# EasyEDA Pro project 2025_07_18_fpga.epro

# Schematic Schematic1
Board Name: Board1; Create Date: 2025-07-18; Page Name: P1; Project Name: 2025_07_18_fpga; Schematic Name: Schematic1; Update Date: 2025-07-22; Page Size: A4; Version: V1.0
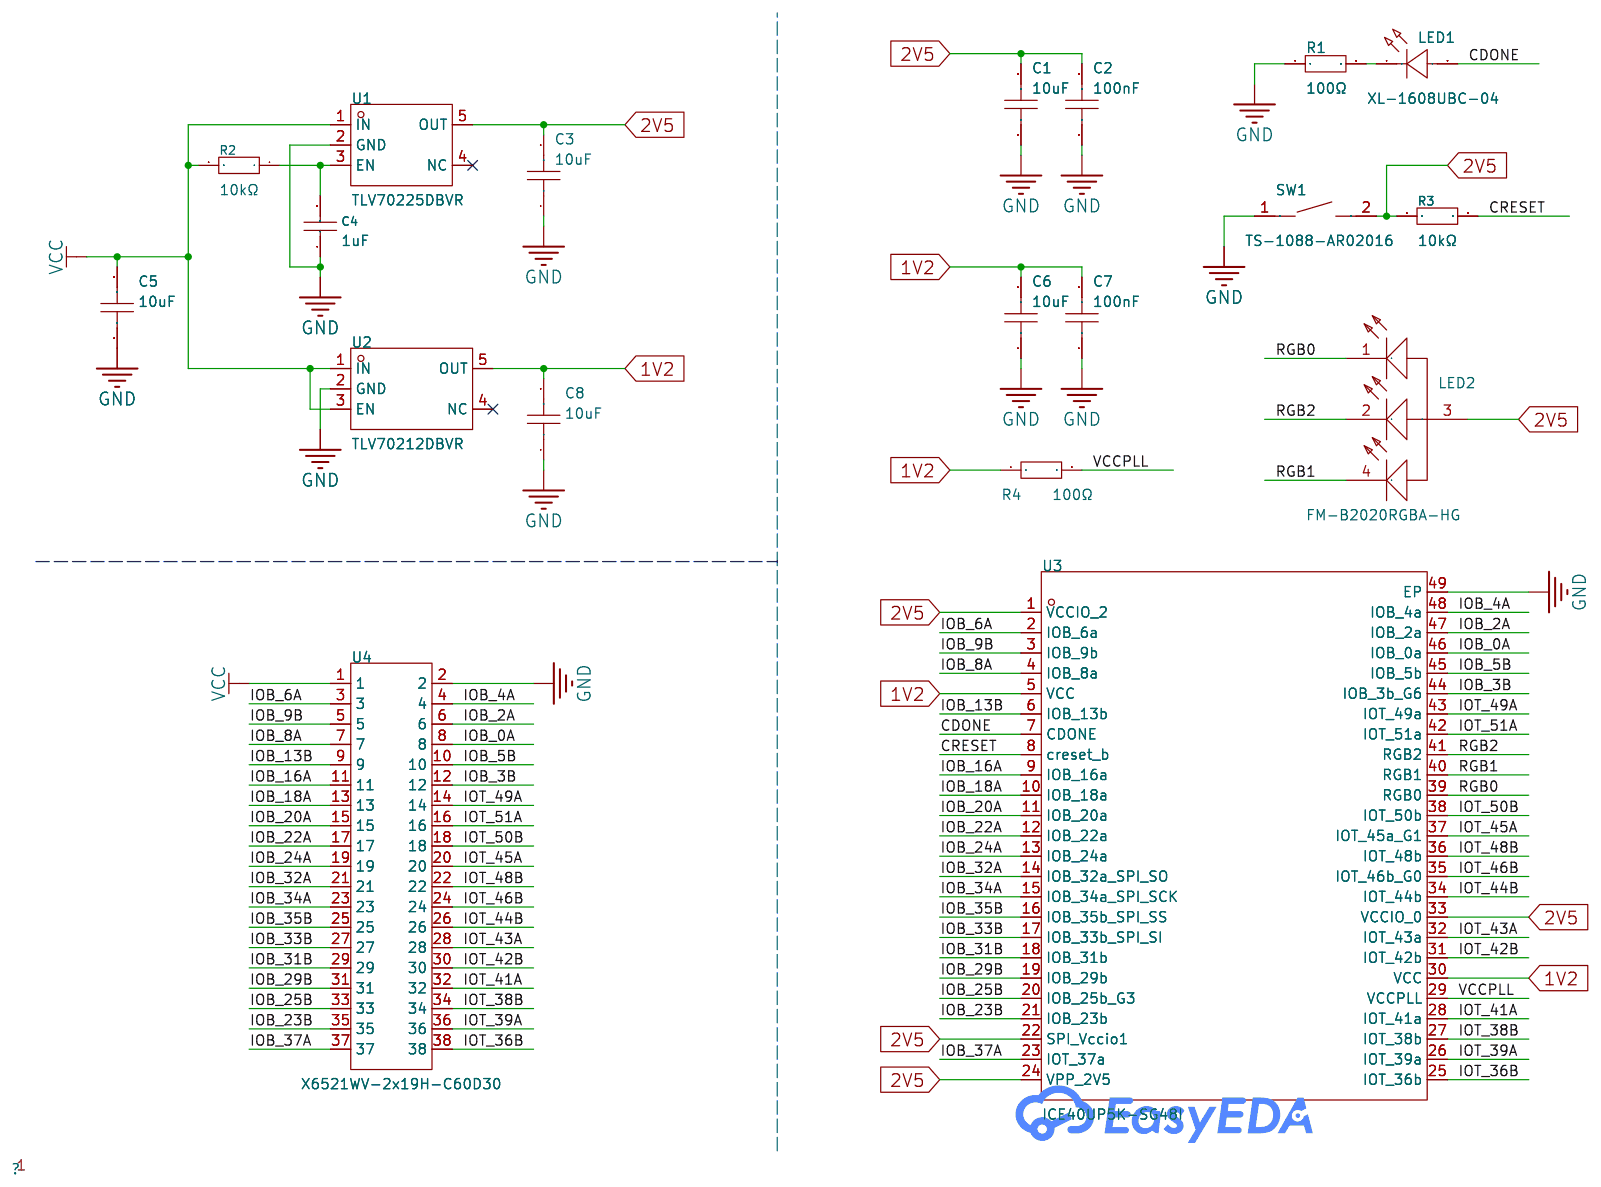
[diagram p0: schematic sheet]

## Parts
C1  10uF  [C0402]
C2  100nF  [C0402]
C3  10uF  [C0402]
C4  1uF  [C0402]
C5  10uF  [C0402]
C6  10uF  [C0402]
C7  100nF  [C0402]
C8  10uF  [C0402]
LED1  XL-1608UBC-04  [LED0603-RD_BLUE]
LED2  FM-B2020RGBA-HG  [LED-SMD_FM-B2020RGBA-HG]
R1  100Ω  [R0402]
R2  10kΩ  [R0402]
R3  10kΩ  [R0402]
R4  100Ω  [R0402]
SW1  TS-1088-AR02016  [SW-SMD_L3.9-W3.0-P4.45]
U1  TLV70225DBVR  [SOT-23-5_L2.9-W1.6-P0.95-LS2.8-BR]
U2  TLV70212DBVR  [SOT-23-5_L3.0-W1.7-P0.95-LS2.8-BL]
U3  ICE40UP5K-SG48I  [QFN-48_L7.0-W7.0-P0.50-TL-EP5.4-1]
U4  X6521WV-2x19H-C60D30  [HDR-TH_38P-P2.54-V-M-R2-C19-S2.54]

## Library data of the parts
C1 C3 C5 C6 C8 = CL05A106MP5NUNC_C315248: Capacitance: Tolerance:±20% Tolerance:±20% Voltage Rated: Temperature Coefficient:; LCSC Part Name: 10uF ±20% 10V; Supplier Part: C315248; Manufacturer: SAMSUNG(三星); Manufacturer Part: CL05A106MP5NUNC; Supplier Footprint: 0402; JLCPCB Part Class: Extended Part; Datasheet: https://atta.szlcsc.com/upload/public/pdf/source/20231220/1EF805BAE1520675928CC4638D279E74.pdf; Supplier: LCSC; Tolerance: ±20%
C2 C7 = CL05B104KO5NNNC: Capacitance: Tolerance:±10% Tolerance:±10% Voltage Rated: Temperature Coefficient:; LCSC Part Name: 100nF ±10% 16V; Supplier Part: C1525; Manufacturer: SAMSUNG(三星); Supplier Footprint: 0402; JLCPCB Part Class: Basic Part; Datasheet: https://atta.szlcsc.com/upload/public/pdf/source/20160218/1457707763339.pdf; Supplier: LCSC; Tolerance: ±10%
C4 = CL05A105KO5NNNC: Capacitance: Tolerance:±10% Tolerance:±10% Voltage Rated: Temperature Coefficient:; LCSC Part Name: 1uF ±10% 16V; Supplier Part: C29266; Manufacturer: SAMSUNG(三星); Supplier Footprint: 0402; JLCPCB Part Class: Extended Part; Datasheet: https://atta.szlcsc.com/upload/public/pdf/source/20160218/1457707763339.pdf; Supplier: LCSC; Tolerance: ±10%
LED1 = XL-1608UBC-04: Emitted Color:Blue Power Dissipation:80mW Forward Current:25mA Dominant Wavelength:460nm~469nm Dominant Wavelength:460nm~469nm Peak Wavelength:475nm Lens Color:无色透明透镜 Color Temperature:- Color Temperature:- Viewing Angle:120° Mounting Sytle:Positive post; Supplier Part: C965807; Manufacturer: XINGLIGHT(成兴光); Supplier Footprint: 0603; JLCPCB Part Class: Extended Part; Datasheet: https://atta.szlcsc.com/upload/public/pdf/source/20240218/F76B043D1CDACE9DB8357580572EF0D5.pdf; Supplier: LCSC; Emitted Color: Blue; Power Dissipation: 80mW; Forward Current: 25mA; Dominant Wavelength: 460nm~469nm; Peak Wavelength: 475nm; Lens Color: 无色透明透镜; Viewing Angle: 120°; Mounting Sytle: Positive post; Operating Temperature: -30℃~+85℃
LED2 = FM-B2020RGBA-HG: Diode Configuration:Common Anode Dominant Wavelength:B:470nm；G:525nm；R:622nm Luminous Intensity:G:170mcd；R:55mcd；B:25mcd Viewing Angle:110° Forward Current:R:8mA；G:5mA；B:3mA Forward Voltage:R:2V；B:3V；G:3V Installation Method:Positive Stick Operating Tempe; Supplier Part: C108793; Manufacturer: 国星光电; Supplier Footprint: SMD,2.1x2.1mm; JLCPCB Part Class: Extended Part; Datasheet: https://atta.szlcsc.com/upload/public/pdf/source/20180518/C108793_2518890ED811E900864AC79152D9E220.pdf; Supplier: LCSC; Diode Configuration: Common Anode; Dominant Wavelength: B:470nm；G:525nm；R:622nm; Luminous Intensity: G:170mcd；R:55mcd；B:25mcd; Viewing Angle: 110°; Forward Current: R:8mA；G:5mA；B:3mA; Forward Voltage: R:2V；B:3V；G:3V; Installation Method: Positive Stick; Operating Temperature: -30℃~+85℃
R1 R4 = RC0402FR-07100RL: Type:Thick Film Resistors Resistance: Tolerance:±1% Tolerance:±1% Power(Watts): Overload Voltage (Max): Temperature Coefficient:±100ppm/℃ Temperature Coefficient:±100ppm/℃ Operating Temperature Range:-55℃~+155℃ Operating Temperature Range:-55℃~+155℃; LCSC Part Name: 厚膜电阻 100Ω ±1% 62.5mW; Supplier Part: C106232; Manufacturer: YAGEO(国巨); Supplier Footprint: 0402; JLCPCB Part Class: Extended Part; Datasheet: https://atta.szlcsc.com/upload/public/pdf/source/20180927/C295883_E8D83085EA81BD7DE0B2B681138C15EE.pdf; Supplier: LCSC; Type: Thick Film Resistors; Tolerance: ±1%; Temperature Coefficient: ±100ppm/℃; Operating Temperature Range: -55℃~+155℃
R2 R3 = 0402WGJ0103TCE: Type:Thick Film Resistors Resistance:10kΩ Tolerance:±5% Tolerance:±5% Power(Watts): Overload Voltage (Max): Temperature Coefficient:±100ppm/℃ Temperature Coefficient:±100ppm/℃ Operating Temperature Range:-55℃~+155℃ Operating Temperature Range:-55℃~+155℃; LCSC Part Name: 10kΩ ±5% 62.5mW 厚膜电阻; Supplier Part: C25531; Manufacturer: UNI-ROYAL(厚声); Supplier Footprint: 0402; Datasheet: https://atta.szlcsc.com/upload/public/pdf/source/20200306/C422600_1E6D84923E4A46A82E41ADD87F860B5C.pdf; Supplier: LCSC; Type: Thick Film Resistors; Tolerance: ±5%; Temperature Coefficient: ±100ppm/℃; Operating Temperature Range: -55℃~+155℃
SW1 = TS-1088-AR02016: Circuit:SPST Actuator Style:Round Button Operating Force:160gf Mounting Style:Brick nogging Switch Length:4mm Switch Width:3mm Switch Height:2mm Strike Gundam:不带 Contact Current:50mA Voltage Rating (DC):12V Insulation Resistance:100MΩ Actuator/Cap Color:B; LCSC Part Name: 4*3*2mm 立贴 轻触开关; Supplier Part: C720477; Manufacturer: XUNPU(讯普); Supplier Footprint: SMD; JLCPCB Part Class: Basic Part; Datasheet: https://atta.szlcsc.com/upload/public/pdf/source/20200810/C720475_60D09DD6C54279ADDB2DC25100F1CC11.pdf; Supplier: LCSC; Circuit: SPST; Actuator Style: Round Button; Operating Force: 160gf; Mounting Style: Brick nogging; Switch Length: 4mm; Switch Width: 3mm; Switch Height: 2mm; Strike Gundam: 不带; Contact Current: 50mA; Voltage Rating (DC): 12V; Insulation Resistance: 100MΩ; Actuator/Cap Color: Black; Pin Style: SMDSplicing; Mechanical Life: 10万次; Operating Temperature: -30℃~+80℃
U1 = TLV70225DBVR: Output Type:Fixed Maximum Input Voltage:5.5V Output Voltage:2.5V Output Voltage:2.5V Output Current:300mA Power Supply Rejection Ratio (PSRR):68dB@(1kHz) Dropout Voltage:380mV@(300mA) standby current:55uA Feature:防静电保护；自动放电功能；低ESR；Thermal Protection(TSD)；; LCSC Part Name: 具有使能功能的 300mA、高 PSRR、低 IQ、低压降稳压器; Supplier Part: C2877849; Manufacturer: TI(德州仪器); Supplier Footprint: SOT-23-5; JLCPCB Part Class: Extended Part; Datasheet: https://www.ti.com/cn/lit/gpn/tlv702; Supplier: LCSC; Output Type: Fixed; Maximum Input Voltage: 5.5V; Output Voltage: 2.5V; Output Current: 300mA; Power Supply Rejection Ratio (PSRR): 68dB@(1kHz); Dropout Voltage: 380mV@(300mA); standby current: 55uA; Feature: 防静电保护；自动放电功能；低ESR；Thermal Protection(TSD)；欠压闭锁；Overcurrent Protection(OCP)；带使能; Operating Temperature: -40℃~+125℃@(Tj); Output Polarity: Positive electrode; Number of Outputs: 1
U2 = TLV70212DBVR: Output Type:Fixed Maximum Input Voltage:5.5V Output Voltage:1.2V Output Voltage:1.2V Output Current:300mA Power Supply Rejection Ratio (PSRR):68dB@(1kHz) Dropout Voltage:380mV@(300mA) standby current:55uA Feature:ESD Protection；Low ESR；Thermal Protection(; LCSC Part Name: 具有使能功能的 300mA、高 PSRR、低 IQ、低压降稳压器; Supplier Part: C81462; Manufacturer: TI(德州仪器); Supplier Footprint: SOT-23-5; JLCPCB Part Class: Extended Part; Datasheet: https://www.ti.com/cn/lit/gpn/tlv702; Supplier: LCSC; Output Type: Fixed; Maximum Input Voltage: 5.5V; Output Voltage: 1.2V; Output Current: 300mA; Power Supply Rejection Ratio (PSRR): 68dB@(1kHz); Dropout Voltage: 380mV@(300mA); standby current: 55uA; Feature: ESD Protection；Low ESR；Thermal Protection(TSD)；Under-voltage Lockout；Overcurrent Protection(OCP)；With ability; Operating Temperature: -40℃~+125℃@(Tj); Output Polarity: Positive electrode; Number of Outputs: 1
U3 = ICE40UP5K-SG48I: Type:- Supply Voltage Range - VCCIO:- Supply Voltage Range - VCCIO:- Logic Elements / Cells:5280 Logic Array Blocks:660 Embedded Block RAM:1171456bit Operating Temperature Range:-40℃~+100℃ Operating Temperature Range:-40℃~+100℃; LCSC Part Name: ICE40UP5K SG48I; Supplier Part: C2678152; Manufacturer: LATTICE(莱迪思); Supplier Footprint: QFN-48-EP(7x7); JLCPCB Part Class: Extended Part; Datasheet: https://atta.szlcsc.com/upload/public/pdf/source/20210913/C2889329_82E663D90B49CAF53877542F8A43E4F7.pdf; Supplier: LCSC; Logic Elements / Cells: 5280; Logic Array Blocks: 660; Embedded Block RAM: 1171456bit; Operating Temperature Range: -40℃~+100℃
U4 = X6521WV-2x19H-C60D30: Pin Structure:2x19P Pitch:2.54mm Row Spacing:2.54mm Circluar Pins/Square Pins:Policy Number of Rows:Double Row Number of Pins:38P Current Rating:3A Voltage Rating (Max):250V Length of Mating Pin:- Insulation Height:2.5mm Length of End Connection Pin:- Con; LCSC Part Name: 2x19P 间距:2.54mm 方针; Supplier Part: C2883962; Manufacturer: XKB Connection(中国星坤); Supplier Footprint: 插件,P=2.54mm; Supplier: LCSC; Pin Structure: 2x19P; Pitch: 2.54mm; Row Spacing: 2.54mm; Circluar Pins/Square Pins: Policy; Number of Rows: Double Row; Number of Pins: 38P; Current Rating: 3A; Voltage Rating (Max): 250V; Insulation Height: 2.5mm; Contact Material: Brass; Contact Plating: Gold; Operating Temperature: -40℃~+105℃; Color: Black

## Nets
1V2: C6.2 C7.2 C8.2 R4.1 U2.5(OUT) U3.5(VCC) U3.30(VCC)
2V5: C1.2 C2.2 C3.2 LED2.3(A) R3.1 SW1.2 U1.5(OUT) U3.1(VCCIO_2) U3.22(SPI_Vccio1) U3.24(VPP_2V5) U3.33(VCCIO_0)
GND: C1.1 C2.1 C3.1 C4.1 C5.1 C6.1 C7.1 C8.1 R1.1 SW1.1 U1.2(GND) U2.2(GND) U3.49(EP) U4.2
VCC: C5.2 R2.2 U1.1(IN) U2.1(IN) U2.3(EN) U4.1
VCCPLL: R4.2 U3.29(VCCPLL)
CDONE: LED1.2(A) U3.7(CDONE)
CRESET: R3.2 U3.8(creset_b)
IOB_0A: U3.46(IOB_0a) U4.8
IOB_2A: U3.47(IOB_2a) U4.6
IOB_3B: U3.44(IOB_3b_G6) U4.12
IOB_4A: U3.48(IOB_4a) U4.4
IOB_5B: U3.45(IOB_5b) U4.10
IOB_6A: U3.2(IOB_6a) U4.3
IOB_8A: U3.4(IOB_8a) U4.7
IOB_9B: U3.3(IOB_9b) U4.5
IOB_13B: U3.6(IOB_13b) U4.9
IOB_16A: U3.9(IOB_16a) U4.11
IOB_18A: U3.10(IOB_18a) U4.13
IOB_20A: U3.11(IOB_20a) U4.15
IOB_22A: U3.12(IOB_22a) U4.17
IOB_23B: U3.21(IOB_23b) U4.35
IOB_24A: U3.13(IOB_24a) U4.19
IOB_25B: U3.20(IOB_25b_G3) U4.33
IOB_29B: U3.19(IOB_29b) U4.31
IOB_31B: U3.18(IOB_31b) U4.29
IOB_32A: U3.14(IOB_32a_SPI_SO) U4.21
IOB_33B: U3.17(IOB_33b_SPI_SI) U4.27
IOB_34A: U3.15(IOB_34a_SPI_SCK) U4.23
IOB_35B: U3.16(IOB_35b_SPI_SS) U4.25
IOB_37A: U3.23(IOT_37a) U4.37
IOT_36B: U3.25(IOT_36b) U4.38
IOT_38B: U3.27(IOT_38b) U4.34
IOT_39A: U3.26(IOT_39a) U4.36
IOT_41A: U3.28(IOT_41a) U4.32
IOT_42B: U3.31(IOT_42b) U4.30
IOT_43A: U3.32(IOT_43a) U4.28
IOT_44B: U3.34(IOT_44b) U4.26
IOT_45A: U3.37(IOT_45a_G1) U4.20
IOT_46B: U3.35(IOT_46b_G0) U4.24
IOT_48B: U3.36(IOT_48b) U4.22
IOT_49A: U3.43(IOT_49a) U4.14
IOT_50B: U3.38(IOT_50b) U4.18
IOT_51A: U3.42(IOT_51a) U4.16
RGB0: LED2.1(K) U3.39(RGB0)
RGB1: LED2.4(K) U3.40(RGB1)
RGB2: LED2.2(K) U3.41(RGB2)
$1N3199: C4.2 R2.1 U1.3(EN)
$1N4221: LED1.1(K) R1.2

Not connected (* = marked no-connect by the designer): U1 4(NC)*; U2 4(NC)*

# Board PCB1
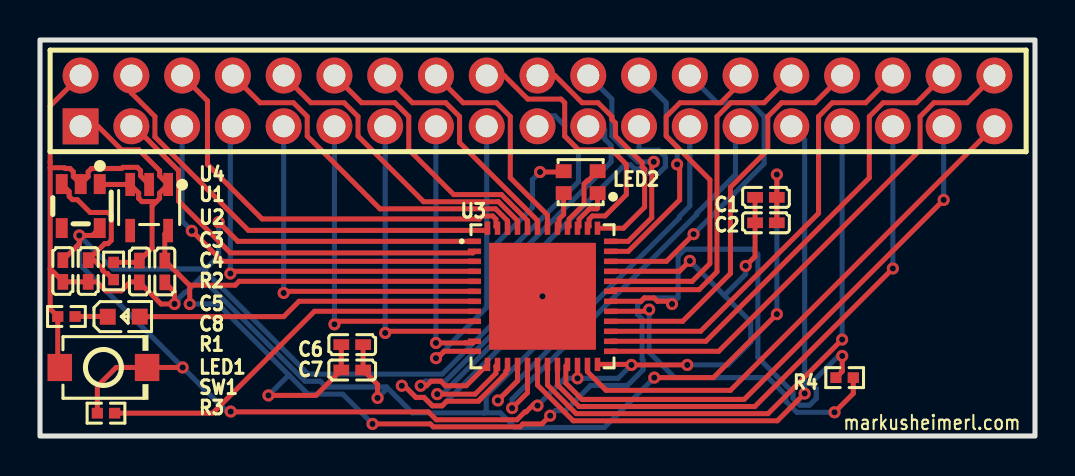
[diagram p1: board, top side]
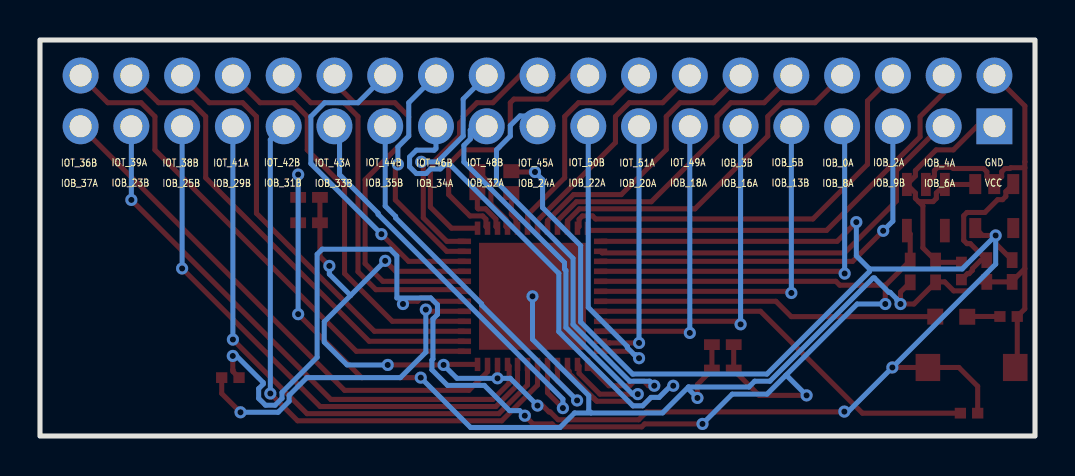
[diagram p2: board, bottom side, seen from below]

Outline 49.78 x 19.81 mm; copper layers: Top Layer, Bottom Layer. Coordinates in mm from the lower left corner of the outline.
Outline path: rectangle 0,19.81 49.78,0
Stack: Top Layer 0.035mm / Dielectric1 1.51mm FR4 er 4.5 / Bottom Layer 0.035mm

## Design rules (mm)
template: JLCPCB Capability(Two Layers Board)
spacing copperThickness1oz (default): track to track 0.102, other pairs 0.152 to 0.3
spacing copperThickness2oz: track to track 0.203, other pairs 0.152 to 0.3
track width copperThickness1oz (default): min 0.127, default 0.254, max 2.54
track width copperThickness2oz: min 0.203, default 0.254, max 2.54
differential pair differentialPair (default): width min 0.127, default 0.254, max 2.54; gap min 0.152, default 0.152
via viaSize (default): diameter min 0.5, default 0.61, max 10; hole min 0.3, default 0.305, max 6.3

## Placement (name value [footprint] x y rotation side)
C1  10uF  [C0402]  36.32 11.94 180 top
C2  100nF  [C0402]  36.32 10.67 180 top
C3  10uF  [C0402]  1.14 8.25 90 top
C4  1uF  [C0402]  2.41 8.25 90 top
C5  10uF  [C0402]  4.97 8.23 90 top
C6  10uF  [C0402]  15.62 4.57 180 top
C7  100nF  [C0402]  15.62 3.3 180 top
C8  10uF  [C0402]  6.25 8.23 90 top
LED1  XL-1608UBC-04  [LED0603-RD_BLUE]  4.19 5.97 0 top
LED2  FM-B2020RGBA-HG  [LED-SMD_FM-B2020RGBA-HG]  27.05 12.7 180 top
R1  100Ω  [R0402]  1.32 5.98 0 top
R2  10kΩ  [R0402]  3.68 8.25 90 top
R3  10kΩ  [R0402]  3.3 1.14 0 top
R4  100Ω  [R0402]  40.26 2.92 0 top
SW1  TS-1088-AR02016  [SW-SMD_L3.9-W3.0-P4.45]  3.17 3.43 0 top
U1  TLV70225DBVR  [SOT-23-5_L2.9-W1.6-P0.95-LS2.8-BR]  2.04 11.5 90 top
U2  TLV70212DBVR  [SOT-23-5_L3.0-W1.7-P0.95-LS2.8-BL]  5.46 11.43 180 top
U3  ICE40UP5K-SG48I  [QFN-48_L7.0-W7.0-P0.50-TL-EP5.4-1]  25.14 6.99 0 top
U4  X6521WV-2x19H-C60D30  [HDR-TH_38P-P2.54-V-M-R2-C19-S2.54]  24.89 16.76 0 top

## Footprints (pads in the part's own frame, mm; a bottom-side part is the same pattern mirrored in y, then rotated)
C0402
  rect 0.79x0.54 smd: 1(-0.545,0) 2(0.545,0)
HDR-TH_38P-P2.54-V-M-R2-C19-S2.54
  rect 1.8x1.8 hole 1.1: 1(-22.86,-1.27)
  round 1.8 hole 1.1: 2(-22.86,1.27) 3(-20.32,-1.27) 4(-20.32,1.27) 5(-17.78,-1.27) 6(-17.78,1.27) 7(-15.24,-1.27) 8(-15.24,1.27) 9(-12.7,-1.27) 10(-12.7,1.27) 11(-10.16,-1.27) 12(-10.16,1.27) 13(-7.62,-1.27) 14(-7.62,1.27) 15(-5.08,-1.27) 16(-5.08,1.27) 17(-2.54,-1.27) 18(-2.54,1.27) 19(0,-1.27) 20(0,1.27) 21(2.54,-1.27) 22(2.54,1.27) 23(5.08,-1.27) 24(5.08,1.27) 25(7.62,-1.27) 26(7.62,1.27) 27(10.16,-1.27) 28(10.16,1.27) 29(12.7,-1.27) 30(12.7,1.27) 31(15.24,-1.27) 32(15.24,1.27) 33(17.78,-1.27) 34(17.78,1.27) 35(20.32,-1.27) 36(20.32,1.27) 37(22.86,-1.27) 38(22.86,1.27)
LED0603-RD_BLUE
  rect 0.8x0.8 smd: 1(-0.799,-0.004) 2(0.799,0.004)
LED-SMD_FM-B2020RGBA-HG
  rect 0.8x0.7 smd: 1(-0.85,0.55) 2(0.85,0.55) 3(0.85,-0.55) 4(-0.85,-0.55)
QFN-48_L7.0-W7.0-P0.50-TL-EP5.4-1
  rect 0.665x0.28 smd: 1(-3.408,2.75) 2(-3.408,2.25) 3(-3.408,1.75) 4(-3.408,1.25) 5(-3.408,0.75) 6(-3.408,0.25) 7(-3.408,-0.25) 8(-3.408,-0.75) 9(-3.408,-1.25) 10(-3.408,-1.75) 11(-3.408,-2.25) 12(-3.408,-2.75) 25(3.408,-2.75) 26(3.408,-2.25) 27(3.408,-1.75) 28(3.408,-1.25) 29(3.408,-0.75) 30(3.408,-0.25) 31(3.408,0.25) 32(3.408,0.75) 33(3.408,1.25) 34(3.408,1.75) 35(3.408,2.25) 36(3.408,2.75)
  rect 0.28x0.665 smd: 13(-2.75,-3.408) 14(-2.25,-3.408) 15(-1.75,-3.408) 16(-1.25,-3.408) 17(-0.75,-3.408) 18(-0.25,-3.408) 19(0.25,-3.408) 20(0.75,-3.408) 21(1.25,-3.408) 22(1.75,-3.408) 23(2.25,-3.408) 24(2.75,-3.408) 37(2.75,3.408) 38(2.25,3.408) 39(1.75,3.408) 40(1.25,3.408) 41(0.75,3.408) 42(0.25,3.408) 43(-0.25,3.408) 44(-0.75,3.408) 45(-1.25,3.408) 46(-1.75,3.408) 47(-2.25,3.408) 48(-2.75,3.408)
  rect 5.35x5.35 smd: 49(0,0)
R0402
  rect 0.566x0.54 smd: 1(-0.433,0) 2(0.433,0)
SOT-23-5_L2.9-W1.6-P0.95-LS2.8-BR
  rect 1x0.6 smd: 1(1.1,-0.95) 2(1.1,0) 3(1.1,0.95) 4(-1.1,0.95) 5(-1.1,-0.95)
SOT-23-5_L3.0-W1.7-P0.95-LS2.8-BL
  rect 0.49x1.157 smd: 1(-0.95,-1.153) 2(0,-1.153) 3(0.95,-1.153)
  rect 0.49x1.175 smd: 4(0.95,1.153) 5(-0.95,1.153)
SW-SMD_L3.9-W3.0-P4.45
  rect 1.23x1.36 smd: 1(-2.185,0) 2(2.185,0)

## Nets
As in the schematic.

Pads without a net: U1 4; U2 4

## Via types
v1: diameter 0.61, hole 0.305, Top Layer to Bottom Layer, 44 vias

## Routing (per net, layer and track width the routed paths; a pad name or vN(x,y) marks a point on that pad's centre or on a via; arc(x,y) is an arc through that point)
1V2: length 80.6
  Top Layer w0.254: U3.30 30.07,6.74 30.24,6.91 30.72,6.91 30.89,6.74 31.49,6.74 v1(31.62,6.6) ; v1(7.49,6.6) 7.49,7.53 7.48,7.54 ; R4.1 40.13,3.22 40.13,3.31 40.14,3.31 v1(40.14,4.01) ; 7.48,7.54 9.77,7.54 9.96,7.74 U3.5 ; 7.48,7.54 C8.2 6.25,10.11 U2.5 ; v1(16.64,0.61) 19.53,0.61 19.68,0.46 24.01,0.46 24.16,0.61 25.12,0.61 v1(25.53,1.02) ; v1(11.43,2.03) 13.81,2.03 C7.2 C6.2
  Bottom Layer w0.254: v1(25.53,1.02) 25.78,1.27 26.29,1.27 27.55,2.53 29.39,2.53 30.18,3.31 30.18,3.8 30.12,3.85 30.12,5.85 29.9,6.08 29.9,6.57 30.24,6.91 31.93,6.91 31.93,9 32.27,9.35 35.66,9.35 35.92,9.09 35.92,3.94 37.68,2.18 37.68,1.88 38.02,1.54 38.5,1.54 38.84,1.88 38.84,2.37 38.62,2.6 38.62,2.67 39.95,4.01 v1(40.14,4.01) ; v1(11.43,2.03) 12.44,3.04 12.46,3.04 ; v1(16.64,0.61) 15.15,2.1 13.41,2.1 12.46,3.04 ; 12.46,3.04 8.9,6.6 v1(7.49,6.6)
2V5: length 116.4
  Top Layer w0.254: v1(24.89,1.52) 24.83,1.59 24.7,1.59 24.32,1.21 24.26,1.21 23.86,0.81 19.83,0.81 19.44,1.21 9.56,1.21 v1(9.54,1.22) ; U3.24 29.56,3.58 v1(29.59,3.56) v1(32.38,3.56) ; v1(25.02,13.21) 26.16,13.21 LED2.3 ; v1(26.9,2.89) 26.9,3.58 U3.22 ; C3.2 1.97,9.63 v1(1.97,10.03) 2.62,10.03 U1.5 ; v1(32.51,8.76) 31.99,8.24 U3.33 ; v1(35.31,8.51) 35.78,8.98 35.78,11.94 ; v1(8.94,10.7) 9.9,9.74 U3.1 ; R3.1 2.87,2.49 3.81,3.43 SW1.2 v1(7.14,3.43)
  Bottom Layer w0.254: v1(29.59,3.56) 28.92,2.89 v1(26.9,2.89) 26.25,2.89 v1(24.89,1.52) ; v1(25.02,13.21) 24.64,12.83 24.64,11.43 22.73,9.52 22.73,5.7 20.13,3.1 13.41,3.1 8.28,8.23 8.28,8.36 ; 8.28,8.36 3.64,8.36 v1(1.97,10.03) 1.97,8.6 v1(7.14,3.43) 9.34,1.22 v1(9.54,1.22) ; 8.28,8.36 8.94,9.02 v1(8.94,10.7) ; v1(32.51,8.76) 34.24,7.03 ; 34.24,7.03 35.31,8.1 v1(35.31,8.51) ; 34.24,7.03 35.56,5.72 35.56,4.7 34.42,3.56 v1(32.38,3.56)
GND: length 86.8
  Top Layer w0.254: 0.51,8.37 1.14,7.74 C3.1 C4.1 2.85,7.71 3.3,7.26 4.07,7.26 4.52,7.71 4.95,7.71 C5.1 6.06,6.6 v1(6.73,6.6) 6.73,7.2 C8.1 ; 0.51,8.37 0.51,13.42 ; 0.51,8.37 0.51,6.36 R1.1 ; U4.2 0.51,16.51 0.51,13.72 0.51,13.71 0.51,13.42 ; v1(36.87,13.08) C1.1 C2.1 ; C6.1 C7.1 16.89,2.58 v1(16.89,1.91) ; 0.51,13.42 1.22,13.42 1.26,13.38 1.5,13.38 1.67,13.22 1.67,12.97 U1.2 2.41,12.97 2.41,13.22 2.57,13.38 4.09,13.38 4.15,13.44 4.87,13.44 5.03,13.28 5.03,13.01 U2.2 ; 0.89,3.43 0.89,5.98 ; v1(30.73,2.92) 33.69,2.92 v1(36.87,6.1)
  Bottom Layer w0.254: 22.21,1.16 18.64,1.16 17.34,2.45 ; 22.21,1.16 23.04,1.16 23.77,0.43 28.24,0.43 v1(30.73,2.92) ; 22.21,1.16 22.33,1.27 22.33,2.02 25.14,4.84 v1(25.14,6.99) ; v1(16.89,1.91) 17.34,2.35 17.34,2.45 ; 17.34,2.45 14.32,2.45 14.03,2.74 13.26,2.74 8.1,7.91 8.03,7.91 7.31,7.19 7.25,7.19 6.91,6.85 6.91,6.78 v1(6.73,6.6) ; v1(36.87,13.08) v1(36.87,6.1)
VCC: length 14.8
  Top Layer w0.254: 5.82,11.73 5.98,11.89 5.98,12.16 U2.1 5.98,13.01 5.98,13.28 4.95,14.31 4.08,14.31 2.9,15.49 U4.1 ; 5.82,11.73 5.1,11.73 4.94,11.89 4.94,12.16 U2.3 3.01,12.58 2.99,12.6 ; 5.82,11.73 5.61,11.51 5.61,9.41 C5.2 4.89,8.69 R2.2
VCCPLL: length 16.9
  Top Layer w0.254: U3.29 30.4,6.24 v1(30.48,6.32) ; v1(39.75,1.19) 40.69,2.13 R4.2
  Bottom Layer w0.254: v1(30.48,6.32) 30.48,4.19 31.75,2.92 36.43,2.92 37.32,2.03 37.32,1.74 37.87,1.19 v1(39.75,1.19)
CDONE: length 17.1
  Top Layer w0.254: LED1.2 12.2,5.97 12.96,6.74 U3.7
CRESET: length 20.1
  Top Layer w0.254: U3.8 13.73,6.24 8.64,1.14 R3.2
IOB_0A: length 17.7
  Top Layer w0.254: U3.46 23.39,10.77 22.79,11.36 17.01,11.36 13.37,15.01 13.37,15.98 12.68,16.67 11.01,16.67 U4.8
IOB_2A: length 21.1
  Top Layer w0.254: U3.47 22.81,10.48 22.81,10.85 22.65,11.01 22.14,11.01 21.99,10.86 11.11,10.86 8.38,13.59 8.38,16.76 U4.6
IOB_3B: length 14
  Top Layer w0.254: U3.44 24.39,10.77 23.09,12.08 20.7,12.08 18.45,14.33 18.45,15.98 17.76,16.67 16.09,16.67 U4.12
IOB_4A: length 22.2
  Top Layer w0.254: U3.48 22.28,10.29 10.43,10.29 5.75,14.97 5.75,15.98 4.57,17.16 U4.4
IOB_5B: length 15.7
  Top Layer w0.254: U3.45 23.89,10.77 22.94,11.72 19.2,11.72 15.91,15.01 15.91,15.98 15.22,16.67 13.55,16.67 U4.10
IOB_6A: length 20.7
  Top Layer w0.254: U4.3 4.93,15.13 5.08,15.13 6.94,13.28 6.94,11.75 9.53,9.16 21.65,9.16 U3.2
IOB_8A: length 19.7
  Top Layer w0.254: v1(9.53,8.13) 9.64,8.24 U3.4
  Bottom Layer w0.254: v1(9.53,8.13) 9.53,15.37 U4.7
IOB_9B: length 20.2
  Top Layer w0.254: U3.3 9.12,8.74 v1(7.6,10.27)
  Bottom Layer w0.254: v1(7.6,10.27) 7.11,10.75 U4.5
IOB_13B: length 17.9
  Top Layer w0.254: U3.6 12.28,7.24 v1(12.19,7.16)
  Bottom Layer w0.254: U4.9 v1(12.19,7.16)
IOB_16A: length 17
  Top Layer w0.254: U3.9 14.88,5.74 v1(14.73,5.59)
  Bottom Layer w0.254: U4.11 v1(14.73,5.59)
IOB_18A: length 14.8
  Top Layer w0.254: v1(17.27,5.16) 17.36,5.24 U3.10
  Bottom Layer w0.254: U4.13 v1(17.27,5.16)
IOB_20A: length 12.8
  Top Layer w0.254: v1(19.81,4.66) 21.28,4.66 21.29,4.66 21.65,4.66 U3.11
  Bottom Layer w0.254: U4.15 v1(19.81,4.66)
IOB_22A: length 14.8
  Top Layer w0.254: U3.12 20.22,4.24 20.05,4.07 19.99,4.07 v1(19.81,3.89)
  Bottom Layer w0.254: v1(19.81,3.89) 19.99,4.07 20.05,4.07 20.4,4.41 20.4,4.48 22.35,6.43 U4.17
IOB_23B: length 28
  Top Layer w0.254: U3.21 26.31,3.5 26.31,2.64 27.12,1.83 35.23,1.83 v1(45.21,11.81)
  Bottom Layer w0.254: U4.35 v1(45.21,11.81)
IOB_24A: length 22.9
  Top Layer w0.254: U3.13 21.32,2.52 20.28,2.52 20.05,2.74 19.57,2.74 19.34,2.52 v1(19.05,2.52)
  Bottom Layer w0.254: v1(19.05,2.52) 19.28,2.74 20.28,2.74 23.11,5.58 23.11,8.89 26.94,12.72 26.94,14.31 26.25,15.01 26.25,15.53 25.77,16.01 25.41,16.01 U4.19
IOB_25B: length 28.2
  Top Layer w0.254: v1(42.67,8.38) 35.76,1.47 26.97,1.47 25.89,2.56 U3.20
  Bottom Layer w0.254: U4.33 v1(42.67,8.38)
IOB_29B: length 28.6
  Top Layer w0.254: U3.19 25.39,2.55 26.83,1.12 36.42,1.12 v1(40.13,4.83)
  Bottom Layer w0.254: U4.31 v1(40.13,4.83)
IOB_31B: length 29.3
  Top Layer w0.254: v1(38.26,2.13) 36.89,0.76 26.68,0.76 24.89,2.55 U3.18
  Bottom Layer w0.254: v1(38.26,2.13) 38.26,14.83 U4.29
IOB_32A: length 21.8
  Top Layer w0.254: U3.14 22.81,3.5 22.81,3.13 21.77,2.1 v1(19.88,2.1)
  Bottom Layer w0.254: U4.21 28.07,15.49 28.25,15.31 28.25,14.86 28.57,14.54 28.57,13.71 23.54,8.68 23.54,8.35 23.47,8.28 23.47,5.43 20.13,2.1 v1(19.88,2.1)
IOB_33B: length 21.3
  Top Layer w0.254: v1(23.62,1.4) 24.39,2.17 U3.17
  Bottom Layer w0.254: U4.27 34.8,15.24 34.8,13.08 32.87,11.15 32.87,11.09 23.62,1.85 v1(23.62,1.4)
IOB_34A: length 30.5
  Top Layer w0.254: v1(18.1,2.52) 18.22,2.52 18.81,1.93 19.21,1.93 19.63,1.51 20.12,1.51 20.35,1.74 21.92,1.74 21.95,1.77 21.96,1.77 22.05,1.86 22.05,1.87 23.17,2.99 23.17,2.99 23.31,3.13 23.31,3.25 23.39,3.33 U3.15
  Bottom Layer w0.254: v1(18.1,2.52) 18.22,2.52 18.81,1.93 19.21,1.93 19.63,1.51 20.12,1.51 23.83,5.22 23.83,8.14 29.26,13.57 29.54,13.57 29.75,13.36 30.24,13.36 30.47,13.13 30.95,13.13 31.29,13.47 31.29,13.96 30.95,14.3 30.06,14.3 29.97,14.38 U4.23
IOB_35B: length 19.9
  Top Layer w0.254: v1(22.91,1.78) 23.89,2.76 U3.16
  Bottom Layer w0.254: U4.25 32.51,11.51 31.99,10.98 31.99,10.91 27.69,6.61 27.69,6.56 v1(22.91,1.78)
IOB_37A: length 26.6
  Top Layer w0.254: U4.37 34.54,2.29 28.32,2.29 27.39,3.22 U3.23
IOT_36B: length 25.9
  Top Layer w0.254: U3.25 33.96,4.24 44.03,14.31 44.03,15.98 44.72,16.67 46.39,16.67 U4.38
IOT_38B: length 22.3
  Top Layer w0.254: U3.27 33.05,5.24 38.95,11.14 38.95,15.98 39.64,16.67 41.31,16.67 U4.34
IOT_39A: length 24
  Top Layer w0.254: U4.36 43.85,16.67 42.18,16.67 41.49,15.98 41.49,12.92 33.31,4.74 U3.26
IOT_41A: length 20.2
  Top Layer w0.254: U4.32 38.77,16.67 37.1,16.67 36.41,15.98 36.41,14.31 34.54,12.45 34.54,8.13 32.16,5.74 U3.28
IOT_42B: length 18.1
  Top Layer w0.254: U3.31 28.63,7.32 32.97,7.32 33.87,8.22 33.87,15.98 34.56,16.67 36.23,16.67 U4.30
IOT_43A: length 18.4
  Top Layer w0.254: U4.28 35.05,17.66 34.06,16.67 32.02,16.67 31.33,15.98 31.33,15.01 33.52,12.82 33.52,8.62 32.63,7.74 U3.32
IOT_44B: length 16.6
  Top Layer w0.254: v1(32.7,10.1) 31.34,8.74 U3.34
  Bottom Layer w0.254: U4.26 33.87,16.67 35.54,16.67 36.23,15.98 36.23,13.63 v1(32.7,10.1)
IOT_45A: length 12.6
  Top Layer w0.254: U3.37 29.19,10.4 30.25,11.45 30.25,13.35 30.12,13.47 30.12,13.67 28.79,15.01 28.79,15.66 28.61,15.84 28.61,15.98 27.92,16.67 27.13,16.67 25.76,18.03 U4.20
IOT_46B: length 11.6
  Top Layer w0.254: v1(31.88,13.59) 32,13.46 32,11.81 29.43,9.24 U3.35
  Bottom Layer w0.254: U4.24 31.33,16.67 31.33,15.01 31.88,14.46 v1(31.88,13.59)
IOT_48B: length 11.5
  Top Layer w0.254: v1(30.71,13.72) 30.61,13.61 30.61,10.92 29.43,9.74 U3.36
  Bottom Layer w0.254: v1(30.71,13.72) 29.9,13.72 28.61,15.01 28.61,16.86 U4.22
IOT_49A: length 11.8
  Top Layer w0.254: U4.14 18.63,16.67 20.3,16.67 20.99,15.98 20.99,14.68 24.89,10.78 U3.43
IOT_50B: length 14.2
  Top Layer w0.254: U3.38 27.47,10.48 27.47,10.85 27.64,11.01 28.27,11.01 29.34,12.07 29.34,13.59 28.61,14.31 26.94,14.31 26.25,15.01 26.25,16.67 26.07,16.86 24.4,16.86 23.22,18.03 U4.18
IOT_51A: length 10.9
  Top Layer w0.254: U4.16 21.17,16.67 22.84,16.67 23.53,15.98 23.53,12.92 25.39,11.06 U3.42
RGB0: length 2.4
  Top Layer w0.254: LED2.1 27.9,11.41 27.86,11.36 27.49,11.36 26.97,10.85 26.97,10.48 U3.39
RGB1: length 3.5
  Top Layer w0.254: U3.40 26.47,10.48 26.47,10.85 27.22,11.6 27.22,12.62 27.39,12.78 27.43,12.78 LED2.4
RGB2: length 1.9
  Top Layer w0.254: U3.41 25.97,10.48 25.97,10.86 26.2,11.08 LED2.2
$1N3199: length 7.8
  Top Layer w0.254: U1.3 1.46,12.23 1.46,11.99 1.62,11.82 1.87,11.82 2.51,11.18 3.41,11.18 3.57,11.02 3.57,9.79 3.41,9.62 3.24,9.62 C4.2 2.7,8.8 3.13,8.37 3.13,8.29 3.3,8.13 3.38,8.13 R2.1
$1N4221: length 1.6
  Top Layer w0.254: LED1.1 3.38,5.98 R1.2

## Text on the board
Bottom Silkscreen Layer: GND | VCC | IOB_4A | IOB_6A | IOB_2A | IOB_9B | IOB_0A | IOB_8A | IOB_5B | IOB_13B | IOB_3B | IOB_16A | IOT_49A | IOB_18A | IOT_51A | IOB_20A | IOT_50B | IOB_22A | IOT_45A | IOB_24A | IOT_48B | IOB_32A | IOT_46B | IOB_34A | IOT_44B | IOB_35B | IOT_43A | IOB_33B | IOT_42B | IOB_31B | IOT_41A | IOB_29B | IOT_38B | IOB_25B | IOT_39A | IOB_23B | IOT_36B | IOB_37A
Top Silkscreen Layer: markusheimerl.com
